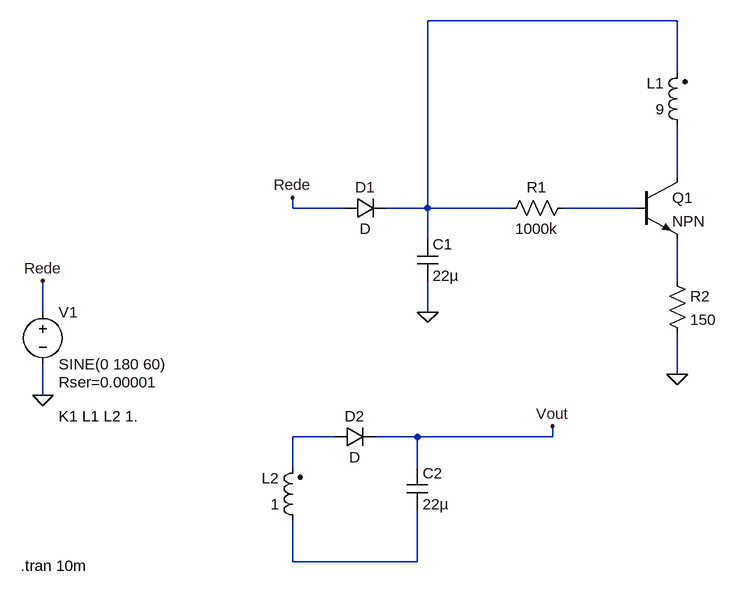
[diagram p0: schematic Draft1.asc]
Draft1.asc, the LTspice schematic file:
Version 4
SHEET 1 980 680
WIRE 912 -288 528 -288
WIRE 912 -208 912 -288
WIRE 912 -48 912 -128
WIRE 320 0 320 -16
WIRE 400 0 320 0
WIRE 528 0 528 -288
WIRE 528 0 464 0
WIRE 656 0 528 0
WIRE 848 0 736 0
WIRE 528 48 528 0
WIRE 912 112 912 48
WIRE -64 160 -64 112
WIRE 528 160 528 112
WIRE 912 256 912 192
WIRE -64 288 -64 240
WIRE 384 352 320 352
WIRE 512 352 448 352
WIRE 720 352 720 336
WIRE 720 352 512 352
WIRE 320 400 320 352
WIRE 512 400 512 352
WIRE 320 544 320 480
WIRE 512 544 512 464
WIRE 512 544 320 544
FLAG -64 288 0
FLAG -64 112 Rede
FLAG 528 160 0
FLAG 320 -16 Rede
FLAG 912 256 0
FLAG 720 336 Vout
SYMBOL voltage -64 144 R0
WINDOW 123 0 0 Left 0
WINDOW 39 24 124 Left 2
SYMATTR InstName V1
SYMATTR Value SINE(0 180 60)
SYMATTR SpiceLine Rser=0.00001
SYMBOL diode 400 16 R270
WINDOW 0 32 32 VTop 2
WINDOW 3 0 32 VBottom 2
SYMATTR InstName D1
SYMBOL cap 512 48 R0
SYMATTR InstName C1
SYMATTR Value 22µ
SYMBOL res 752 -16 R90
WINDOW 0 0 56 VBottom 2
WINDOW 3 32 56 VTop 2
SYMATTR InstName R1
SYMATTR Value 1000k
SYMBOL npn 848 -48 R0
SYMATTR InstName Q1
SYMBOL res 896 96 R0
SYMATTR InstName R2
SYMATTR Value 150
SYMBOL ind2 928 -112 R180
WINDOW 0 36 80 Left 2
WINDOW 3 36 40 Left 2
SYMATTR InstName L1
SYMATTR Value 9
SYMBOL ind2 336 496 R180
WINDOW 0 36 80 Left 2
WINDOW 3 36 40 Left 2
SYMATTR InstName L2
SYMATTR Value 1
SYMBOL diode 384 368 R270
WINDOW 0 32 32 VTop 2
WINDOW 3 0 32 VBottom 2
SYMATTR InstName D2
SYMBOL cap 496 400 R0
SYMATTR InstName C2
SYMATTR Value 22µ
TEXT -40 320 Left 2 !K1 L1 L2 1.
TEXT -98 550 Left 2 !.tran 10m

The netlist it stands for:
* Draft1.asc
V1 Rede 0 SINE(0 180 60) Rser=0.00001
D1 Rede N001 D
C1 N001 0 22µ
R1 N003 N001 1000k
Q1 N002 N003 N004 0 NPN
R2 N004 0 150
L1 N002 N001 9
L2 N006 N005 1
D2 N005 Vout D
C2 Vout N006 22µ
.model D D
.lib standard.dio
.model NPN NPN
.model PNP PNP
.lib standard.bjt
K1 L1 L2 1.
.tran 10m
.backanno
.end